# EAGLE design 1-WireHumidityLight (EAGLE 7.7.0)
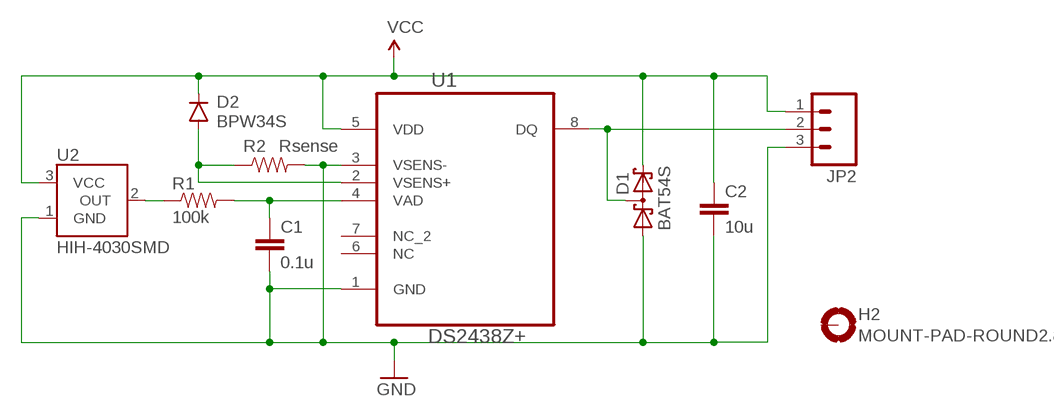
[diagram p0: schematic, sheet 1]

## Parts
C1  0.1u  CAP0603-CAP  [0603-CAP]
C2  10u  CAP0603-CAP  [0603-CAP]
D1  BAT54S  [SOT23]
D2  BPW34S  BPW34SMD  [BPW34S]
H2  MOUNT-PAD-ROUND2.8  [2,8-PAD]
JP2  M03LONGPADS  [1X03_LONGPADS]
R1  100k  RESISTOR0603-RES  [0603-RES]
R2  Rsense  RESISTOR0603-RES  [0603-RES]
U1  DS2438Z+  [SOIC127P600X175-8N]
U2  HIH-4030SMD  [HIH-4030]

## Nets
GND: C1.2 C2.2 D1.1(A1) JP2.3 R2.2 U1.1(GND) U1.3(VSENS-) U2.1(GND)
N$1: R1.1 U2.2(OUT)
N$3: D2.P$1(A) R2.1 U1.2(VSENS+)
QD: D1.3(C1A2) JP2.2 U1.8(DQ)
VAD: C1.1 R1.2 U1.4(VAD)
VCC: C2.1 D1.2(C2) D2.P$2(C) JP2.1 U1.5(VDD) U2.3(VCC)
Unconnected: H2.B2,8(MOUNT) U1.6(NC) U1.7(NC_2)

## Library data of the parts
C1 C2 = SparkFun-Capacitors:CAP: Capacitor Standard 0603 ceramic capacitor, and 0.1" leaded capacitor.
D1 = diode:BAT54S: Schottky Diodes Pin connection corrected 2011-05-04 Source: Fairchild .. BAT54.pdf
D2 = TaaraLabs:BPW34: Large-area PIN photodiode ("miniature solar cell") Datasheet: https://www.sparkfun.com/datasheets/Prototyping/Solar/bpw34.pdf
H2 = holes:MOUNT-PAD-ROUND: MOUNTING PAD, round
JP2 = SparkFun-Connectors:M03: Header 3 Standard 3-pin 0.1" header. Use with straight break away headers (SKU : PRT-00116), right angle break away headers (PRT-00553), swiss pins (PRT-00743), machine pins (PRT-00117), and female headers (PRT-00115). Molex polarized connector foot print use with SKU : PRT-08232 with associated crimp pins and housings.
R1 R2 = SparkFun-Resistors:RESISTOR: Resistor Basic schematic elements and footprints for 0603, 1206, and PTH resistors.
U1 = Maxim-DS2438Z:DS2438Z+: Smart Battery Monitor; MPN: DS2438Z+; OC_FARNELL: 1455593; OC_NEWARK: 27K7484; PACKAGE: SOIC-8; SUPPLIER: Maxim
U2 = SparkFun-Sensors:HIH-4030: Humidity Sensor

## Board
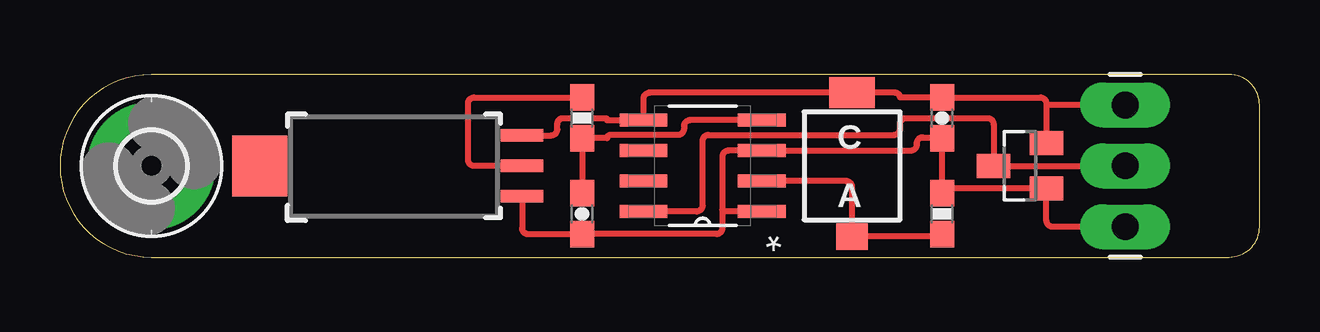
[diagram p1: board, top side]
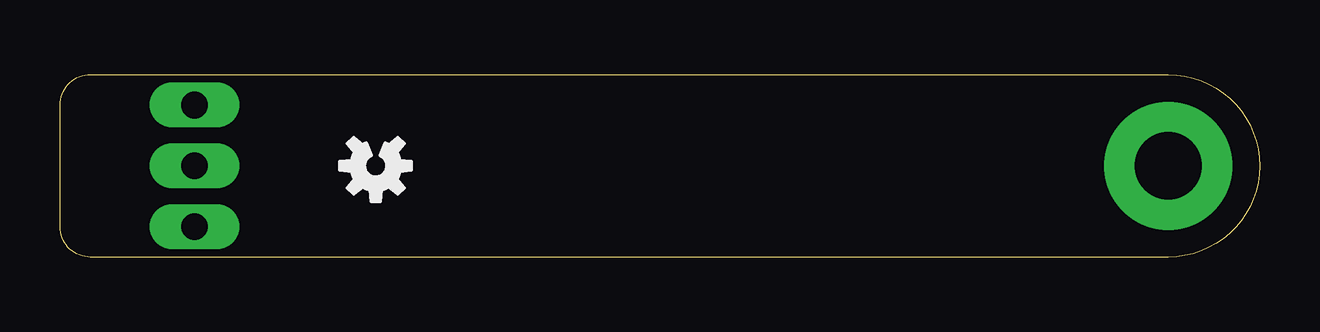
[diagram p2: board, bottom side, seen from below]

Size 49.98 x 7.62 mm. Coordinates in mm from the lower left corner, seen from the top.
Outline: 48.71,7.62 3.81,7.62 arc90 0,3.81 arc90 3.81,0 48.71,0 arc90 49.98,1.27 49.98,6.35 arc90 48.71,7.62
Copper layers (1*16): Top 0.035mm / dielectric 1.5mm / Bottom 0.035mm
Design rules "ITEADstudio_DRC": minimum track width 6mil, minimum drill 12mil, track to track 6mil, track to pad 6mil, pad to pad 6mil, via to via 6mil, smd to smd 0mil, copper to edge 10mil, drill to drill 10mil, minimum pad ring 10mil, minimum via ring 6mil, stop-mask expansion 2mil, vias tented up to drill 100mil, thermal gap 10mil

### Footprints (pad centres in the part's own frame; a part is rotated, then mirrored left to right if it is on the bottom)
0603-CAP = smd 1.1 x 1: 1 -0.85,0; 2 0.85,0
SOT23 = smd 1 x 1.4: 1 -0.95,-1.1; 2 0.95,-1.1; 3 0,1.1
BPW34S = smd 1.3 x 1.1: P$1 0,2.95 | smd 1.9 x 1.3: P$2 0,-3.05
2,8-PAD = drill 2.8 pad 5.334: B2,8 0,0
1X03_LONGPADS = drill 1.118 pad 1.88 long: 1 0,0; 2 2.54,0; 3 5.08,0
0603-RES = smd 1.1 x 1: 1 -0.85,0; 2 0.85,0
SOIC127P600X175-8N = smd 1.981 x 0.533: 1 -2.464,1.905; 2 -2.464,0.635; 3 -2.464,-0.635; 4 -2.464,-1.905; 5 2.464,-1.905; 6 2.464,-0.635; 7 2.464,0.635; 8 2.464,1.905
HIH-4030 = smd 0.508 x 1.778: 1 -1.27,-5.08; 2 0,-5.08; 3 1.27,-5.08 | smd 2.54 x 2.286: NC 0,5.842

### Placement (x,y rotation side)
C1  21.75,1.81 270 top
C2  36.75,5.81 270 top
D1  40,3.81 90 top
D2  33,3.81 180 top
H2  3.81,3.81 0 top
JP2  44.38,6.35 270 top
R1  21.75,5.81 270 top
R2  36.75,1.81 90 top
U1  26.77,3.81 180 top
U2  14.17,3.81 90 top
U$3  [OSHW-LOGO-S]  36.83,3.81 180 bottom

### Tracks (layer width: path | path; a pad name or v marks a point on that pad's centre or on a via)
GND
  Top 0.254: D1.1 41.35,2.61 arc45 41.52,2.54 | JP2.3 41.35,1.27 arc-90 41.1,1.52 D1.1 | 27.6,2 27.6,4.19 arc-90 27.85,4.45 U1.3 35.45,4.45 arc90 35.7,4.7 35.7,4.75 arc-90 35.95,5 36.69,5 C2.2 | 27.6,2 27.6,1.21 arc-90 27.35,0.96 C1.2 19.5,0.96 arc-90 19.25,1.21 U2.1 | C2.2 36.71,4.96 | D1.1 36.75,2.86 R2.2 C2.2 | U1.1 27.7,1.91 arc-90 27.6,2
N$1
  Top 0.254: U2.2 17.25,3.81 arc-90 17,4.06 17,6.41 arc-90 17.25,6.66 R1.1
N$3
  Top 0.254: U1.2 32.75,3.17 arc-90 33,2.92 D2.P$1 36.75,0.86 R2.1
QD
  Top 0.254: JP2.2 D1.3 38.9,5.55 arc90 38.65,5.8 35.25,5.8 arc90 35,5.55 35,5.35 arc-90 34.75,5.1 27.03,5.1 arc90 26.77,4.85 26.77,2.16 arc-90 26.52,1.91 U1.8
VAD
  Top 0.254: C1.1 R1.2 22.8,4.96 arc-90 22.94,5.1 25.75,5.1 arc90 26,5.35 26,5.46 arc-90 26.25,5.71 U1.4
VCC
  Top 0.254: U2.3 20.47,5.08 arc90 20.72,5.33 20.72,5.55 arc-90 20.97,5.8 22.71,5.8 arc-90 22.8,5.71 U1.5 24.31,6.61 arc-90 24.57,6.86 D2.P$2 | JP2.1 41.1,6.35 | 41.1,6.35 D1.2 | 41.1,6.35 41.1,6.41 arc90 40.85,6.66 C2.1 35,6.66 arc90 34.8,6.86 D2.P$2 | D2.P$2 33,6.66

### Text on the board
tValues: VCC | OW | GND
bValues: VCC | taaralabs.eu/ol1 | OW | GND